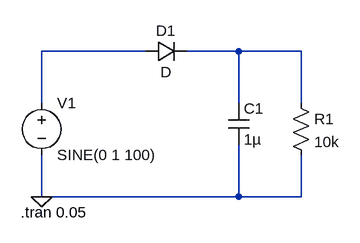
[diagram p0: schematic half-wave-filter.asc]
half-wave-filter.asc, the LTspice schematic file:
Version 4
SHEET 1 880 680
WIRE 176 48 16 48
WIRE 320 48 240 48
WIRE 416 48 320 48
WIRE 16 128 16 48
WIRE 320 128 320 48
WIRE 416 128 416 48
WIRE 16 272 16 208
WIRE 320 272 320 192
WIRE 320 272 16 272
WIRE 416 272 416 208
WIRE 416 272 320 272
FLAG 16 272 0
SYMBOL voltage 16 112 R0
WINDOW 123 0 0 Left 0
WINDOW 39 0 0 Left 0
SYMATTR InstName V1
SYMATTR Value SINE(0 1 100)
SYMBOL diode 176 64 R270
WINDOW 0 32 32 VTop 2
WINDOW 3 0 32 VBottom 2
SYMATTR InstName D1
SYMBOL res 400 112 R0
SYMATTR InstName R1
SYMATTR Value 10k
SYMBOL cap 304 128 R0
SYMATTR InstName C1
SYMATTR Value 1µ
TEXT -16 296 Left 2 !.tran 0.05

The netlist it stands for:
* half-wave-filter.asc
V1 N001 0 SINE(0 1 100)
D1 N001 N002 D
R1 N002 0 10k
C1 N002 0 1µ
.model D D
.lib standard.dio
.tran 0.05
.backanno
.end